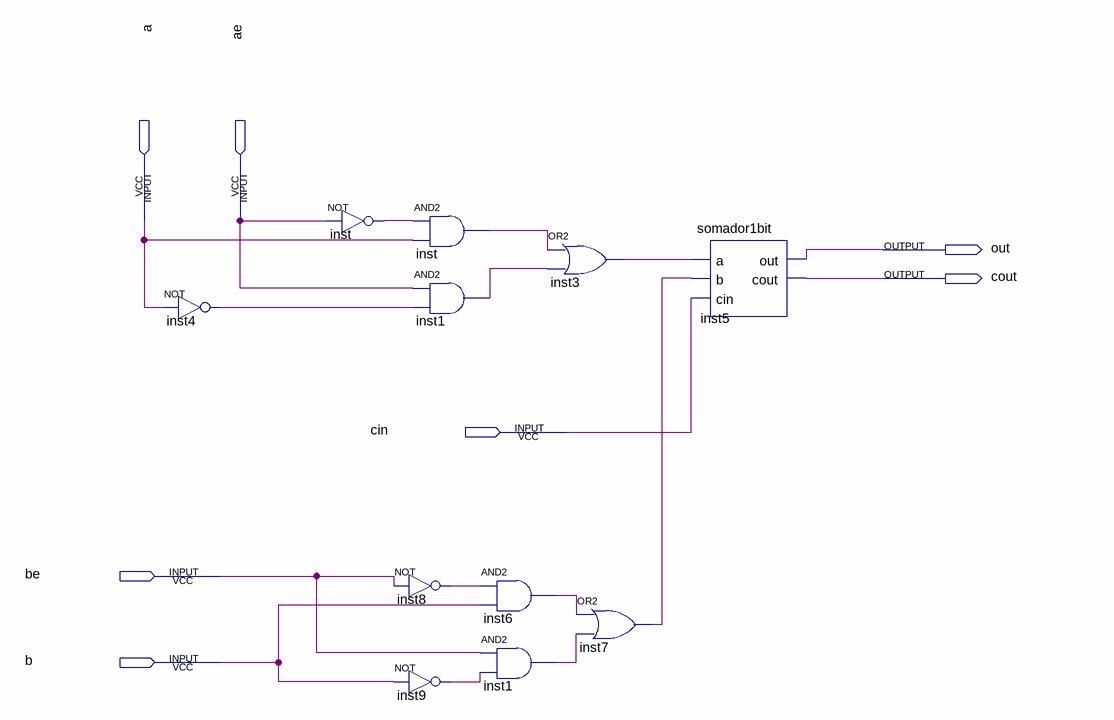
[diagram p0: schematic sheet]
// Quartus schematic Subtrator1bit.bdf as structural Verilog: 11 symbols, 7 pins
module Subtrator1bit (
  input  a,
  input  ae,
  input  cin,
  input  be,
  input  b,
  output out,
  output cout
);

  wire inst1_out, inst1_out_2, inst3_out, inst4_out, inst6_out, inst7_out, inst8_out, inst9_out, inst_out,
       inst_out_2;

  not inst4 (inst4_out, a);
  not inst (inst_out, ae);
  not inst8 (inst8_out, be);
  not inst9 (inst9_out, b);
  and inst_dup2 (inst_out_2, inst_out, a);
  and inst1 (inst1_out, ae, inst4_out);
  and inst6 (inst6_out, inst8_out, b);
  and inst1_dup2 (inst1_out_2, be, inst9_out);
  or inst3 (inst3_out, inst_out_2, inst1_out);
  or inst7 (inst7_out, inst6_out, inst1_out_2);
  somador1bit inst5 (.a(inst3_out), .b(inst7_out), .cin(cin), .out(out), .cout(cout));
endmodule
